# EAGLE design isp (EAGLE 9.6.2)
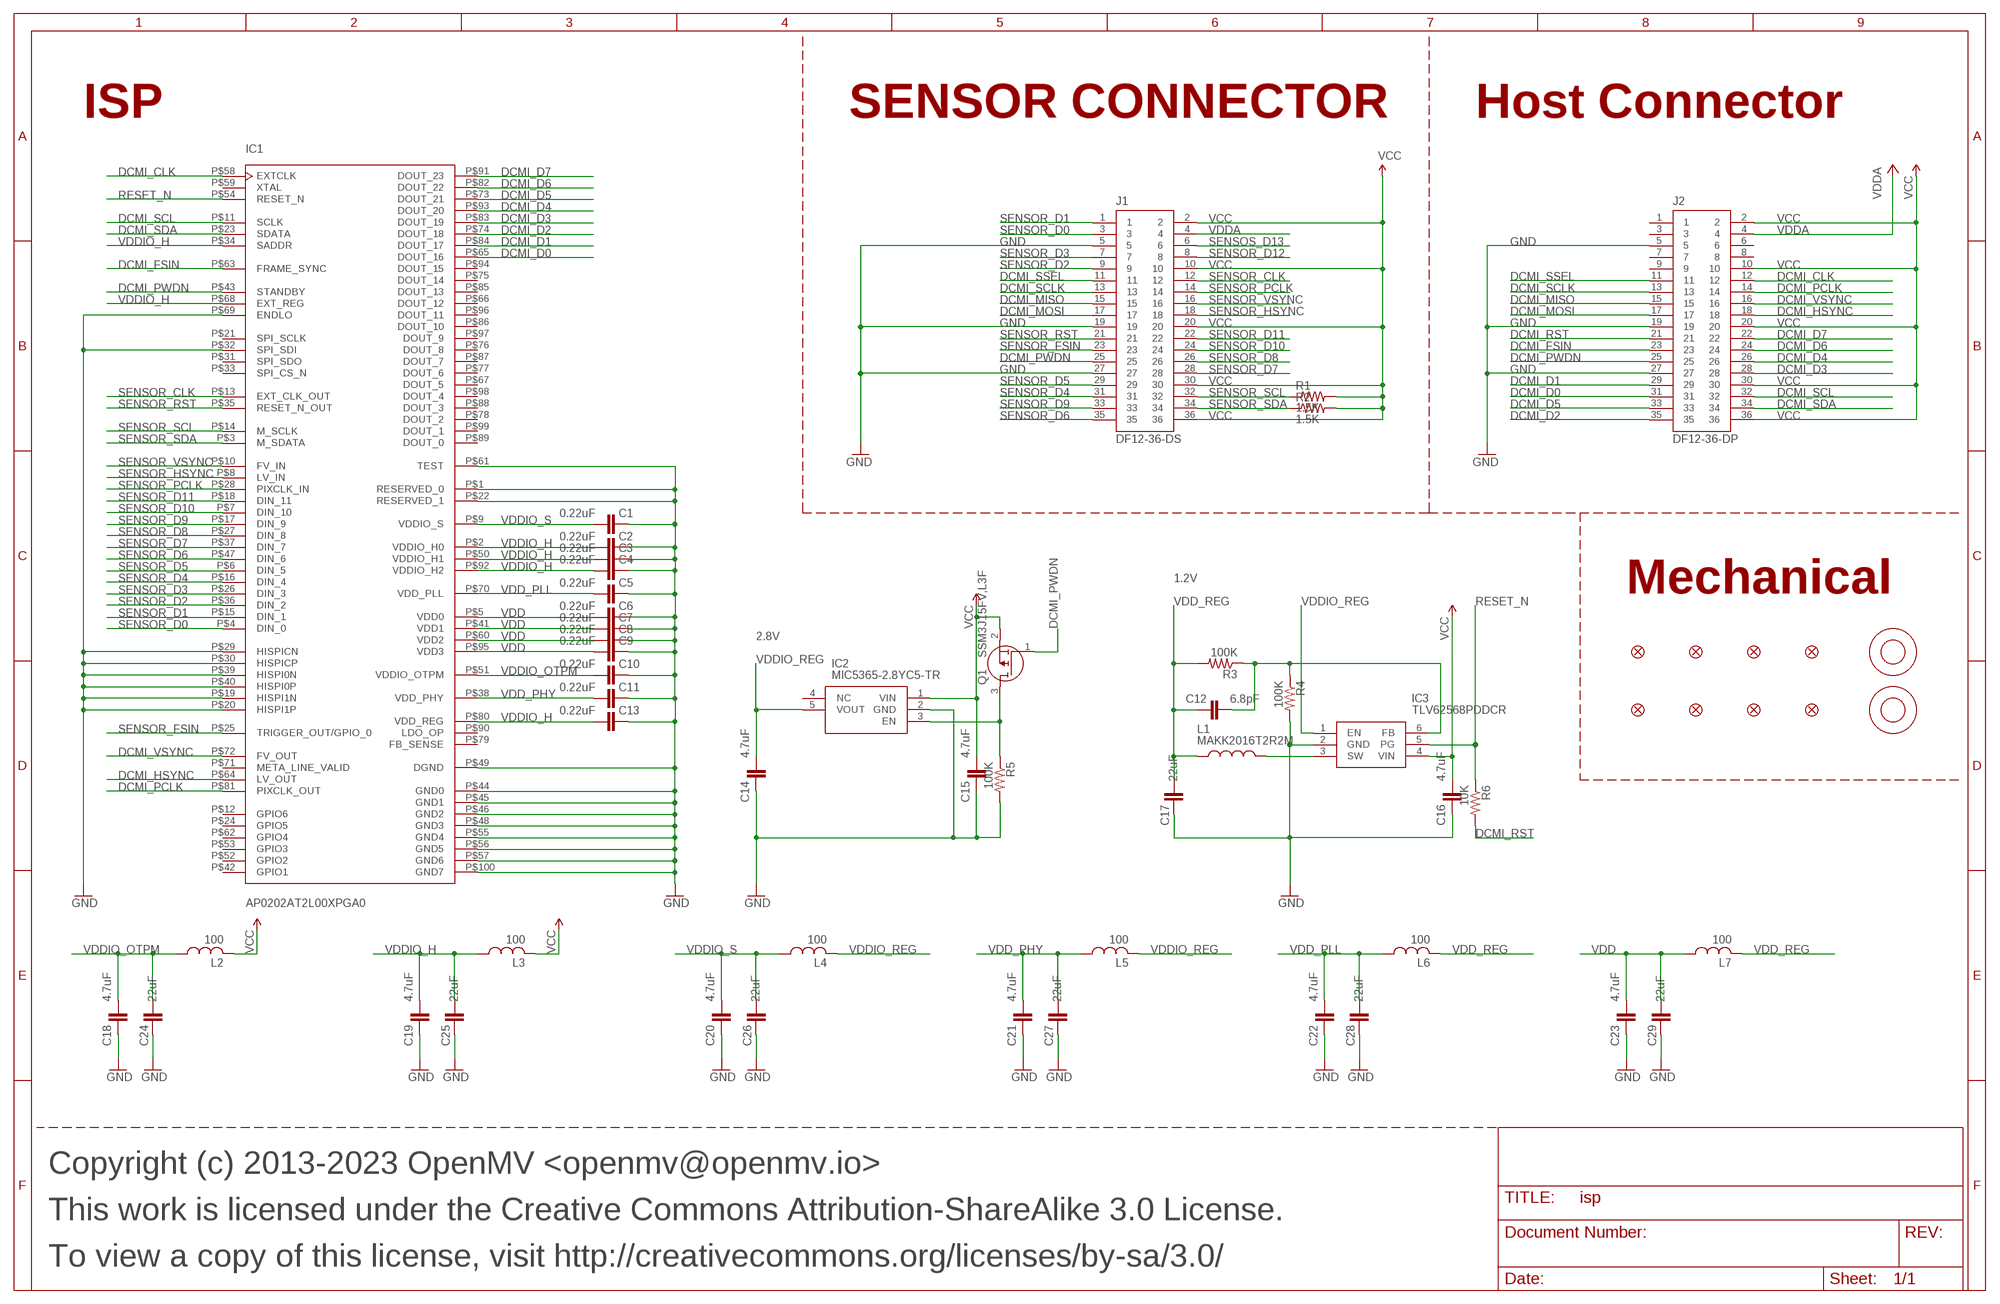
[diagram p0: schematic, sheet 1]

## Parts
C1  0.22uF  C-EUC0201  [C0201]
C2  0.22uF  C-EUC0201  [C0201]
C3  0.22uF  C-EUC0201  [C0201]
C4  0.22uF  C-EUC0201  [C0201]
C5  0.22uF  C-EUC0201  [C0201]
C6  0.22uF  C-EUC0201  [C0201]
C7  0.22uF  C-EUC0201  [C0201]
C8  0.22uF  C-EUC0201  [C0201]
C9  0.22uF  C-EUC0201  [C0201]
C10  0.22uF  C-EUC0201  [C0201]
C11  0.22uF  C-EUC0201  [C0201]
C12  6.8pF  CAP_0402  [0402]
C13  0.22uF  C-EUC0201  [C0201]
C14  4.7uF  CAP_0402  [0402]
C15  4.7uF  CAP_0402  [0402]
C16  4.7uF  CAP_0402  [0402]
C17  22uF  22UF-0805-6.3V-20%  [0805]
C18  4.7uF  CAP_0402  [0402]
C19  4.7uF  CAP_0402  [0402]
C20  4.7uF  CAP_0402  [0402]
C21  4.7uF  CAP_0402  [0402]
C22  4.7uF  CAP_0402  [0402]
C23  4.7uF  CAP_0402  [0402]
C24  22uF  22UF-0805-6.3V-20%  [0805]
C25  22uF  22UF-0805-6.3V-20%  [0805]
C26  22uF  22UF-0805-6.3V-20%  [0805]
C27  22uF  22UF-0805-6.3V-20%  [0805]
C28  22uF  22UF-0805-6.3V-20%  [0805]
C29  22uF  22UF-0805-6.3V-20%  [0805]
FD1  FIDUCIAL1X2  [FIDUCIAL-1X2]
FD2  FIDUCIAL1X2  [FIDUCIAL-1X2]
FD3  FIDUCIAL1X2  [FIDUCIAL-1X2]
FD4  FIDUCIAL1X2  [FIDUCIAL-1X2]
FD5  FIDUCIAL1X2  [FIDUCIAL-1X2]
FD6  FIDUCIAL1X2  [FIDUCIAL-1X2]
FD7  FIDUCIAL1X2  [FIDUCIAL-1X2]
FD8  FIDUCIAL1X2  [FIDUCIAL-1X2]
IC1  AP0202AT2L00XPGA0  [AP0202AT2L00XPGA0]
IC2  MIC5365-2.8YC5-TR  [SOT65P210X110-5N]
IC3  TLV62568PDDCR  [SOT95P280X110-6N]
J1  DF12-36-DS  [DF12-36-DS]
J2  DF12-36-DP  [DF12-36-DP]
L1  MAKK2016T2R2M  [INDC2016X100N]
L2  100  INDUCTOR_0402  [0402]
L3  100  INDUCTOR_0402  [0402]
L4  100  INDUCTOR_0402  [0402]
L5  100  INDUCTOR_0402  [0402]
L6  100  INDUCTOR_0402  [0402]
L7  100  INDUCTOR_0402  [0402]
M1  9774030151R  [9774030151R]
M2  9774030151R  [9774030151R]
Q1  SSM3J15FV,L3F  [SSM3J15FVL3F]
R1  1.5K  R-US_R0402  [R0402]
R2  1.5K  R-US_R0402  [R0402]
R3  100K  R-US_R0402  [R0402]
R4  100K  R-US_R0402  [R0402]
R5  100K  R-US_R0402  [R0402]
R6  10K  R-US_R0402  [R0402]

## Nets
DCMI_CLK [signal]: IC1.P$58(EXTCLK) J2.12
DCMI_D0 [signal]: IC1.P$65(DOUT_16) J2.31
DCMI_D1 [signal]: IC1.P$84(DOUT_17) J2.29
DCMI_D2 [signal]: IC1.P$74(DOUT_18) J2.35
DCMI_D3 [signal]: IC1.P$83(DOUT_19) J2.28
DCMI_D4 [signal]: IC1.P$93(DOUT_20) J2.26
DCMI_D5 [signal]: IC1.P$73(DOUT_21) J2.33
DCMI_D6 [signal]: IC1.P$82(DOUT_22) J2.24
DCMI_D7 [signal]: IC1.P$91(DOUT_23) J2.22
DCMI_FSIN [signal]: IC1.P$63(FRAME_SYNC) J2.23
DCMI_HSYNC [signal]: IC1.P$64(LV_OUT) J2.18
DCMI_MISO [signal]: J1.15 J2.15
DCMI_MOSI [signal]: J1.17 J2.17
DCMI_PCLK [signal]: IC1.P$81(PIXCLK_OUT) J2.14
DCMI_PWDN [signal]: IC1.P$43(STANDBY) J1.25 J2.25 Q1.1(G)
DCMI_PWDN_INT [signal]: IC2.3(EN) Q1.3(D) R5.1
DCMI_RST [signal]: J2.21 R6.2
DCMI_SCL [signal]: IC1.P$11(SCLK) J2.32
DCMI_SCLK [signal]: J1.13 J2.13
DCMI_SDA [signal]: IC1.P$23(SDATA) J2.34
DCMI_SSEL [signal]: J1.11 J2.11
DCMI_VSYNC [signal]: IC1.P$72(FV_OUT) J2.16
FB [pwr]: C12.2 IC3.6(FB) R3.1 R4.1
GND [gnd]: C1.1 C2.1 C3.1 C4.1 C5.1 C6.1 C7.1 C8.1 C9.1 C10.1 C11.1 C13.1 C14.1 C15.1 C16.1 C17.1 C18.1 C19.1 C20.1 C21.1 C22.1 C23.1 C24.1 C25.1 C26.1 C27.1 C28.1 C29.1 IC1.P$1(RESERVED_0) IC1.P$19(HISPI1N) IC1.P$20(HISPI1P) IC1.P$22(RESERVED_1) IC1.P$29(HISPICN) IC1.P$30(HISPICP) IC1.P$32(SPI_SDI) IC1.P$39(HISPI0N) IC1.P$40(HISPI0P) IC1.P$44(GND0) IC1.P$45(GND1) IC1.P$46(GND2) IC1.P$48(GND3) IC1.P$49(DGND) IC1.P$55(GND4) IC1.P$56(GND5) IC1.P$57(GND6) IC1.P$61(TEST) IC1.P$69(ENDLO) IC1.P$100(GND7) IC2.2(GND) IC3.2(GND) J1.5 J1.19 J1.27 J2.5 J2.19 J2.27 R4.2 R5.2
RESET_N [signal]: IC1.P$54(RESET_N) IC3.5(PG) R6.1
SENSOR_CLK [signal]: IC1.P$13(EXT_CLK_OUT) J1.12
SENSOR_D0 [signal]: IC1.P$4(DIN_0) J1.3
SENSOR_D1 [signal]: IC1.P$15(DIN_1) J1.1
SENSOR_D2 [signal]: IC1.P$36(DIN_2) J1.9
SENSOR_D3 [signal]: IC1.P$26(DIN_3) J1.7
SENSOR_D4 [signal]: IC1.P$16(DIN_4) J1.31
SENSOR_D5 [signal]: IC1.P$6(DIN_5) J1.29
SENSOR_D6 [signal]: IC1.P$47(DIN_6) J1.35
SENSOR_D7 [signal]: IC1.P$37(DIN_7) J1.28
SENSOR_D8 [signal]: IC1.P$27(DIN_8) J1.26
SENSOR_D9 [signal]: IC1.P$17(DIN_9) J1.33
SENSOR_D10 [signal]: IC1.P$7(DIN_10) J1.24
SENSOR_D11 [signal]: IC1.P$18(DIN_11) J1.22
SENSOR_D12 [signal]: J1.8
SENSOR_FSIN [signal]: IC1.P$25(TRIGGER_OUT/GPIO_0) J1.23
SENSOR_HSYNC [signal]: IC1.P$8(LV_IN) J1.18
SENSOR_PCLK [signal]: IC1.P$28(PIXCLK_IN) J1.14
SENSOR_RST [signal]: IC1.P$35(RESET_N_OUT) J1.21
SENSOR_SCL [signal]: IC1.P$14(M_SCLK) J1.32 R1.1
SENSOR_SDA [signal]: IC1.P$3(M_SDATA) J1.34 R2.1
SENSOR_VSYNC [signal]: IC1.P$10(FV_IN) J1.16
SENSOS_D13 [signal]: J1.6
SW [pwr]: IC3.3(SW) L1.2
VCC [pwr]: C15.2 C16.2 IC2.1(VIN) IC3.4(VIN) J1.2 J1.10 J1.20 J1.30 J1.36 J2.2 J2.10 J2.20 J2.30 J2.36 L2.2 L3.2 Q1.2(S) R1.2 R2.2
VDD [pwr]: C6.2 C7.2 C8.2 C9.2 C23.2 C29.2 IC1.P$5(VDD0) IC1.P$41(VDD1) IC1.P$60(VDD2) IC1.P$95(VDD3) L7.1
VDD_PHY [pwr]: C11.2 C21.2 C27.2 IC1.P$38(VDD_PHY) L5.1
VDD_PLL [pwr]: C5.2 C22.2 C28.2 IC1.P$70(VDD_PLL) L6.1
VDD_REG [pwr]: C12.1 C17.2 L1.1 L6.2 L7.2 R3.2
VDDA [pwr]: J1.4 J2.4
VDDIO_H [pwr]: C2.2 C3.2 C4.2 C13.2 C19.2 C25.2 IC1.P$2(VDDIO_H0) IC1.P$34(SADDR) IC1.P$50(VDDIO_H1) IC1.P$68(EXT_REG) IC1.P$80(VDD_REG) IC1.P$92(VDDIO_H2) L3.1
VDDIO_OTPM [pwr]: C10.2 C18.2 C24.2 IC1.P$51(VDDIO_OTPM) L2.1
VDDIO_REG [pwr]: C14.2 IC2.5(VOUT) IC3.1(EN) L4.2 L5.2
VDDIO_S [pwr]: C1.2 C20.2 C26.2 IC1.P$9(VDDIO_S) L4.1
Unconnected: IC1.P$12(GPIO6) IC1.P$21(SPI_SCLK) IC1.P$24(GPIO5) IC1.P$31(SPI_SDO) IC1.P$33(SPI_CS_N) IC1.P$42(GPIO1) IC1.P$52(GPIO2) IC1.P$53(GPIO3) IC1.P$59(XTAL) IC1.P$62(GPIO4) IC1.P$66(DOUT_12) IC1.P$67(DOUT_5) IC1.P$71(META_LINE_VALID) IC1.P$75(DOUT_14) IC1.P$76(DOUT_8) IC1.P$77(DOUT_6) IC1.P$78(DOUT_2) IC1.P$79(FB_SENSE) IC1.P$85(DOUT_13) IC1.P$86(DOUT_10) IC1.P$87(DOUT_7) IC1.P$88(DOUT_3) IC1.P$89(DOUT_0) IC1.P$90(LDO_OP) IC1.P$94(DOUT_15) IC1.P$96(DOUT_11) IC1.P$97(DOUT_9) IC1.P$98(DOUT_4) IC1.P$99(DOUT_1) IC2.4(NC) J2.1 J2.3 J2.6 J2.7 J2.8 J2.9

## Notes on the sheet
- ISP | SENSOR CONNECTOR | Host Connector
- 1.2V
- Mechanical
- 2.8V
- Copyright (c) 2013-2023 OpenMV <openmv@openmv.io>
- This work is licensed under the Creative Commons Attribution-ShareAlike 3.0 License.
- To view a copy of this license, visit http://creativecommons.org/licenses/by-sa/3.0/

## Library data of the parts
C1-C11 C13 = rcl:C-EU: CAPACITOR, European symbol; MPN: GRM033R60J224ME15D; SPICEPREFIX: C
C12 = 0402:CAP_0402: 0402 (1005 Metric) Nick Garner - TeleSense; MPN: GRM1555C1H6R8DA01D
C14-C16 C18-C23 = 0402:CAP_0402: 0402 (1005 Metric) Nick Garner - TeleSense; MPN: JMK105BBJ475MV-F
C17 C24-C29 = SparkFun-Capacitors:22UF: 22µF ceramic capacitors A capacitor is a passive two-terminal electrical component used to store electrical energy temporarily in an electric field.; MPN: CL21A226MQQNNNE; PROD_ID: CAP-08402
FD1-FD8 = SparkFun-Aesthetics:FIDUCIAL: Fiducial Alignment Points Point-of-reference for pick-and-place machines and other optical instruments.
IC1 = AP0202AT2L00XPGA0:AP0202AT2L00XPGA0; MPN: AP0202AT2L00XPGA0-DR
IC2 = MIC5365-2.8YC5-TR:MIC5365-2.8YC5-TR: IC REG LINEAR 2.8V 150MA SC70-5 Source: Datasheet <http://www.microchip.com/mymicrochip/filehandler.aspx?ddocname=en580022>; DESCRIPTION: IC REG LINEAR 2.8V 150MA SC70-5; HEIGHT: 1.1mm; MANUFACTURER_NAME: Microchip; MANUFACTURER_PART_NUMBER: MIC5365-2.8YC5-TR; MOUSER_PART_NUMBER: 998-MIC5365-2.8YC5TR; MOUSER_PRICE-STOCK: https://www.mouser.co.uk/ProductDetail/Microchip-Technology-Atmel/MIC5365-2.8YC5-TR?qs=U6T8BxXiZAX3mJDSWJyjVA%3D%3D; MPN: MIC5365-2.8YC5-TR
IC3 = TLV62568PDDCR:TLV62568PDDCR: 2.5V-5.5V input, 1A high efficiency step-down buck converter in SOT23 and SOT563 package Source: Datasheet <http://www.ti.com/lit/gpn/tlv62568>; DESCRIPTION: 2.5V-5.5V input, 1A high efficiency step-down buck converter in SOT23 and SOT563 package; HEIGHT: 1.1mm; MANUFACTURER_NAME: Texas Instruments; MANUFACTURER_PART_NUMBER: TLV62568PDDCR; MOUSER_PART_NUMBER: 595-TLV62568PDDCR; MOUSER_PRICE-STOCK: https://www.mouser.co.uk/ProductDetail/Texas-Instruments/TLV62568PDDCR?qs=1mbolxNpo8f1FPchIXcxyQ%3D%3D; MPN: TLV62568PDDCR
J1 = DF12-36-DS:DF12-36-DS; MPN: DF12NB(3.0)-36DS-0.5V(51)
J2 = DF12NB(3.0)-36DP-0.5V(51):DF12-36-DP; MPN: DF12NB(3.0)-36DP-0.5V(51)
L1 = MAKK2016T2R2M:MAKK2016T2R2M: INDUCTOR, METAL CORE Check availability <https://pricing.snapeda.com/parts/MAKK2016T2R2M/Taiyo%20Yuden/view-part?ref=eda>; AVAILABILITY: In Stock; DESCRIPTION: 2.2 µH Shielded Drum Core, Wirewound Inductor 1.5 A 160mOhm Max 0806 (2016 Metric); MF: Taiyo Yuden; MP: MAKK2016T2R2M; MPN: MAKK2016T2R2M; PACKAGE: 2016 Taiyo Yuden; PRICE: None; PURCHASE-URL: https://pricing.snapeda.com/search/part/MAKK2016T2R2M/?ref=eda
L2-L7 = 0402:INDUCTOR_0402; MPN: MFBM1V1005-101-R
M1 M2 = 9774030151R:9774030151R; MPN: 9774030151R
Q1 = SSM3J15FV_L3F:SSM3J15FV,L3F: MOSFET Small-signal MOSFET High Speed Switching Source: Datasheet <https://toshiba.semicon-storage.com/info/docget.jsp?did=593&prodName=SSM3J15FV>; DESCRIPTION: MOSFET Small-signal MOSFET High Speed Switching; HEIGHT: 0.55mm; MANUFACTURER_NAME: Toshiba; MANUFACTURER_PART_NUMBER: SSM3J15FV,L3F; MOUSER_PART_NUMBER: 757-SSM3J15FVL3F; MOUSER_PRICE-STOCK: https://www.mouser.co.uk/ProductDetail/Toshiba/SSM3J15FVL3F?qs=PDgMCp4xDJb4qTgE7FAUzA%3D%3D; MPN: SSM3J15FV,L3F
R1 R2 = rcl:R-US_: RESISTOR, American symbol; MPN: RC0402FR-131K5L; SPICEPREFIX: R
R3-R5 = rcl:R-US_: RESISTOR, American symbol; MPN: AC0402FR-07100KL; SPICEPREFIX: R
R6 = rcl:R-US_: RESISTOR, American symbol; MPN: AC0402FR-1310KL; SPICEPREFIX: R

## Net classes
0 default: width 0.076 mm, drill 0.102 mm, clearance 0.076 mm
2 gnd: width 0.076 mm, drill 0.102 mm, clearance 0.076 mm to class 0, clearance 0.076 mm to class 1, clearance 0.127 mm
3 pwr: width 0.076 mm, drill 0.102 mm, clearance 0.076 mm to class 0, clearance 0.076 mm to class 1, clearance 0.076 mm to class 2, clearance 0.127 mm
4 signal: width 0.076 mm, drill 0.102 mm, clearance 0.076 mm to class 0, clearance 0.076 mm to class 1, clearance 0.076 mm to class 2, clearance 0.076 mm to class 3, clearance 0.127 mm

## Board
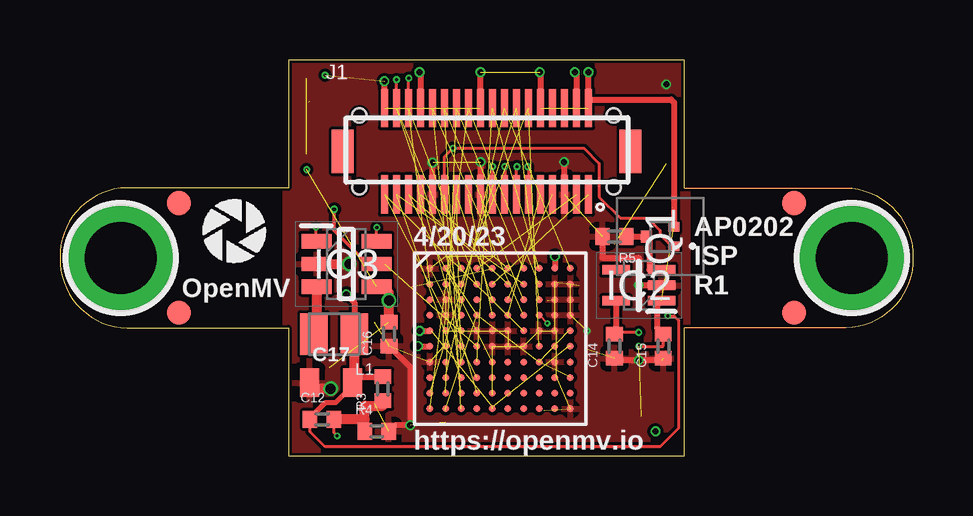
[diagram p1: board, top side]
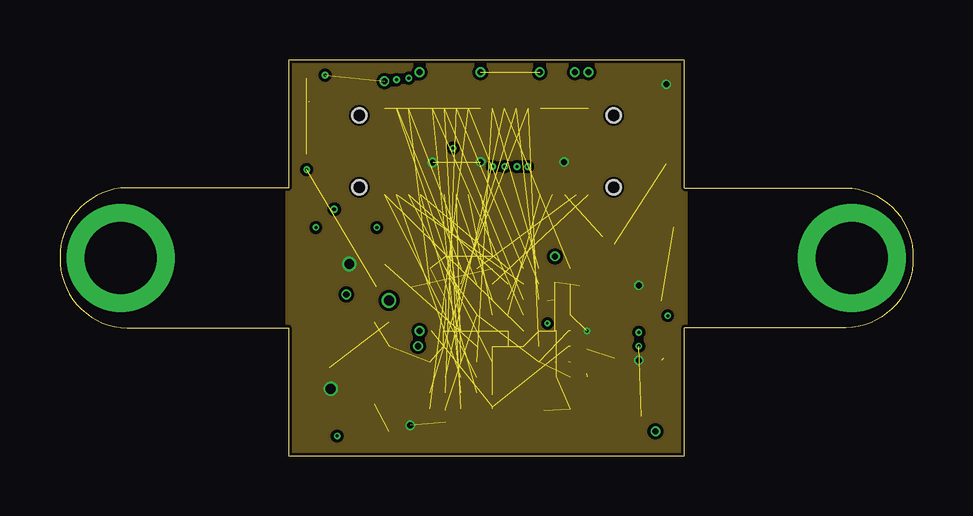
[diagram p2: board, inner layer GND]
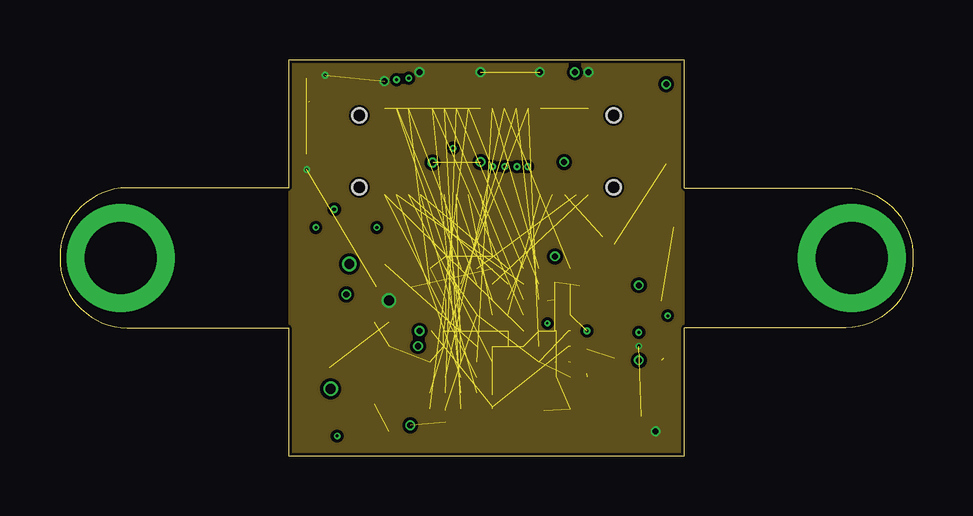
[diagram p3: board, inner layer VCC]
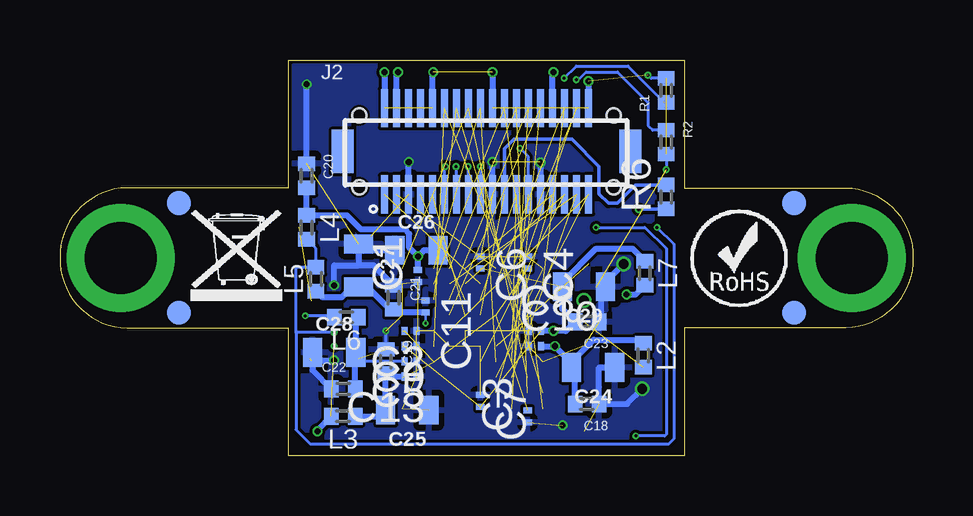
[diagram p4: board, bottom side, seen from below]

Size 35.56 x 16.51 mm. Coordinates in mm from the lower left corner, seen from the top.
Outline: 9.53,16.51 9.53,11.18 2.79,11.18 arc90 0,8.26 arc90 2.79,5.33 9.53,5.33 9.53,0 26.04,0 26.04,5.33 32.77,5.33 arc90 35.56,8.26 arc90 32.77,11.18 26.04,11.18 26.04,16.51 9.53,16.51
Copper layers (1*2*3*14*15*16): Top 0.035mm / dielectric 0.23mm / GND 0.035mm / dielectric 0.38mm / Route3 0.035mm / dielectric 0.15mm / Route14 0.035mm / dielectric 0.38mm / VCC 0.035mm / dielectric 0.23mm / Bottom 0.035mm
Design rules "MF_Ext_4_mil_drill_6_Layer *": minimum track width 3mil, minimum drill 4mil, track to track 3mil, track to pad 3mil, pad to pad 3mil, via to via 3mil, smd to smd 0mil, copper to edge 3mil, drill to drill 3mil, minimum pad ring 3mil, minimum via ring 3mil, stop-mask expansion 2mil, vias tented up to drill 25mil, thermal gap 10mil

### Footprints (pad centres in the part's own frame; a part is rotated, then mirrored left to right if it is on the bottom)
C0201 = smd 0.25 x 0.35: 1 -0.25,0; 2 0.25,0
0402 = smd 0.6 x 0.7: 1 -0.5,0; 2 0.5,0
0805 = smd 0.8 x 1.2: 1 -0.9,0; 2 0.9,0
FIDUCIAL-1X2 = smd 1 x 1: 1 0,0
AP0202AT2L00XPGA0 = smd 0.3 x 0.3: P$1 -2.925,2.925; P$2 -2.275,2.925; P$3 -1.625,2.925; P$4 -0.975,2.925; P$5 -0.325,2.925; P$6 0.325,2.925; P$7 0.975,2.925; P$8 1.625,2.925; P$9 2.275,2.925; P$10 2.925,2.925; P$11 -2.925,2.275; P$12 -2.275,2.275; P$13 -1.625,2.275; P$14 -0.975,2.275; P$15 -0.325,2.275; P$16 0.325,2.275; P$17 0.975,2.275; P$18 1.625,2.275; P$19 2.275,2.275; P$20 2.925,2.275; P$21 -2.925,1.625; P$22 -2.275,1.625; P$23 -1.625,1.625; P$24 -0.975,1.625; P$25 -0.325,1.625; P$26 0.325,1.625; P$27 0.975,1.625; P$28 1.625,1.625; P$29 2.275,1.625; P$30 2.925,1.625; P$31 -2.925,0.975; P$32 -2.275,0.975; P$33 -1.625,0.975; P$34 -0.975,0.975; P$35 -0.325,0.975; P$36 0.325,0.975; P$37 0.975,0.975; P$38 1.625,0.975; P$39 2.275,0.975; P$40 2.925,0.975; P$41 -2.925,0.325; P$42 -2.275,0.325; P$43 -1.625,0.325; P$44 -0.975,0.325; P$45 -0.325,0.325; P$46 0.325,0.325; P$47 0.975,0.325; P$48 1.625,0.325; P$49 2.275,0.325; P$50 2.925,0.325; P$51 -2.925,-0.325; P$52 -2.275,-0.325; P$53 -1.625,-0.325; P$54 -0.975,-0.325; P$55 -0.325,-0.325; P$56 0.325,-0.325; P$57 0.975,-0.325; P$58 1.625,-0.325; P$59 2.275,-0.325; P$60 2.925,-0.325; P$61 -2.925,-0.975; P$62 -2.275,-0.975; P$63 -1.625,-0.975; P$64 -0.975,-0.975; P$65 -0.325,-0.975; P$66 0.325,-0.975; P$67 0.975,-0.975; P$68 1.625,-0.975; P$69 2.275,-0.975; P$70 2.925,-0.975; P$71 -2.925,-1.625; P$72 -2.275,-1.625; P$73 -1.625,-1.625; P$74 -0.975,-1.625; P$75 -0.325,-1.625; P$76 0.325,-1.625; P$77 0.975,-1.625; P$78 1.625,-1.625; P$79 2.275,-1.625; P$80 2.925,-1.625; P$81 -2.925,-2.275; P$82 -2.275,-2.275; P$83 -1.625,-2.275; P$84 -0.975,-2.275; P$85 -0.325,-2.275; P$86 0.325,-2.275; P$87 0.975,-2.275; P$88 1.625,-2.275; P$89 2.275,-2.275; P$90 2.925,-2.275; P$91 -2.925,-2.925; P$92 -2.275,-2.925; P$93 -1.625,-2.925; P$94 -0.975,-2.925; P$95 -0.325,-2.925; P$96 0.325,-2.925; P$97 0.975,-2.925; P$98 1.625,-2.925; P$99 2.275,-2.925; P$100 2.925,-2.925
SOT65P210X110-5N = smd 1.15 x 0.4: 1 -0.95,0.65; 2 -0.95,0; 3 -0.95,-0.65; 4 0.95,-0.65; 5 0.95,0.65
SOT95P280X110-6N = smd 1.25 x 0.6: 1 -1.25,0.95; 2 -1.25,0; 3 -1.25,-0.95; 4 1.25,-0.95; 5 1.25,0; 6 1.25,0.95
DF12-36-DS = smd 0.3 x 1.6: 1 4.25,-1.8; 2 4.25,1.8; 3 3.75,-1.8; 4 3.75,1.8; 5 3.25,-1.8; 6 3.25,1.8; 7 2.75,-1.8; 8 2.75,1.8; 9 2.25,-1.8; 10 2.25,1.8; 11 1.75,-1.8; 12 1.75,1.8; 13 1.25,-1.8; 14 1.25,1.8; 15 0.75,-1.8; 16 0.75,1.8; 17 0.25,-1.8; 18 0.25,1.8; 19 -0.25,-1.8; 20 -0.25,1.8; 21 -0.75,-1.8; 22 -0.75,1.8; 23 -1.25,-1.8; 24 -1.25,1.8; 25 -1.75,-1.8; 26 -1.75,1.8; 27 -2.25,-1.8; 28 -2.25,1.8; 29 -2.75,-1.8; 30 -2.75,1.8; 31 -3.25,-1.8; 32 -3.25,1.8; 33 -3.75,-1.8; 34 -3.75,1.8; 35 -4.25,-1.8; 36 -4.25,1.8 | smd 0.9 x 1.8: F1 6,0; F2 -6,0 | hole 0.6: 5.3,-1.5; -5.3,-1.5
DF12-36-DP = smd 0.3 x 1.6: 1 -4.25,-1.8; 2 -4.25,1.8; 3 -3.75,-1.8; 4 -3.75,1.8; 5 -3.25,-1.8; 6 -3.25,1.8; 7 -2.75,-1.8; 8 -2.75,1.8; 9 -2.25,-1.8; 10 -2.25,1.8; 11 -1.75,-1.8; 12 -1.75,1.8; 13 -1.25,-1.8; 14 -1.25,1.8; 15 -0.75,-1.8; 16 -0.75,1.8; 17 -0.25,-1.8; 18 -0.25,1.8; 19 0.25,-1.8; 20 0.25,1.8; 21 0.75,-1.8; 22 0.75,1.8; 23 1.25,-1.8; 24 1.25,1.8; 25 1.75,-1.8; 26 1.75,1.8; 27 2.25,-1.8; 28 2.25,1.8; 29 2.75,-1.8; 30 2.75,1.8; 31 3.25,-1.8; 32 3.25,1.8; 33 3.75,-1.8; 34 3.75,1.8; 35 4.25,-1.8; 36 4.25,1.8 | smd 0.9 x 1.8: F1 -6,0; F2 6,0 | hole 0.6: -5.3,1.5; 5.3,1.5
INDC2016X100N = smd 1.14 x 1.73: 1 -0.847,0; 2 0.847,0
9774030151R = drill 3 pad 4.5: P$1 0,0
SSM3J15FVL3F = smd 0.4 x 0.45: 1 -0.4,-0.575; 2 0.4,-0.575 | smd 0.5 x 0.45: 3 0,0.575
R0402 = smd 0.6 x 0.7: 1 -0.5,0; 2 0.5,0

### Placement (x,y rotation side)
C1  20.64,7.49 90 bottom
C2  20.95,5.21 180 bottom
C3  16.07,1.65 90 bottom
C4  16.07,8.06 270 bottom
C5  20.95,3.94 180 bottom
C6  18.03,8.06 270 bottom
C7  18.03,2.29 270 bottom
C8  15.75,5.21 0 bottom
C9  20.95,4.57 180 bottom
C10  15.75,4.57 0 bottom
C11  20.32,6.22 270 bottom
C12  10.92,1.52 0 top
C13  20.95,3.3 180 bottom
C14  23.11,4.57 90 top
C15  25.15,4.57 90 top
C16  13.72,5.08 90 top
C17  11.3,3.05 0 top
C18  13.59,2.16 180 bottom
C19  21.97,3.94 270 bottom
C20  25.27,11.68 270 bottom
C21  21.65,6.6 270 bottom
C22  23.75,2.79 0 bottom
C23  13.59,5.59 180 bottom
C24  13.34,3.68 180 bottom
C25  21.08,1.91 180 bottom
C26  20.7,8.57 0 bottom
C27  23.11,7.94 270 bottom
C28  24.13,4.32 0 bottom
C29  13.72,7.05 180 bottom
FD1  30.61,5.97 0 top
FD2  30.61,10.54 0 top
FD3  30.61,10.54 0 bottom
FD4  30.61,5.97 0 bottom
FD5  4.95,5.97 0 top
FD6  4.95,10.54 0 top
FD7  4.95,10.54 0 bottom
FD8  4.95,5.97 0 bottom
IC1  18.35,4.89 0 top
IC2  24.13,7.11 180 top
IC3  11.94,8 0 top
J1  17.78,12.7 0 top
J2  17.78,12.7 0 bottom
L1  11.43,5.08 180 top
L2  11.24,4.19 270 bottom
L3  23.75,1.65 180 bottom
L4  25.27,9.53 270 bottom
L5  24.89,7.37 90 bottom
L6  23.62,5.78 180 bottom
L7  11.18,7.62 270 bottom
M1  2.54,8.26 0 top
M2  33.02,8.26 0 top
Q1  25.02,9.14 90 top
R1  10.29,15.24 90 bottom
R2  10.29,13.08 270 bottom
R3  13.46,2.79 90 top
R4  13.21,1.02 0 top
R5  23.11,9.14 180 top
R6  10.29,10.79 90 bottom
U$1  [WEEE]  30.1,6.48 0 bottom
U$2  [ROHS]  9.27,6.22 0 bottom
U$9  OPENMV-LOGO  [OPENMV-LOGO]  5.84,7.87 0 top

### Tracks (layer width: path | path; a pad name or v marks a point on that pad's centre or on a via)
DCMI_CLK  (1 unrouted)
DCMI_D0  (1 unrouted)
DCMI_D1  (1 unrouted)
DCMI_D2  (1 unrouted)
DCMI_D3  (1 unrouted)
DCMI_D4  (1 unrouted)
DCMI_D5  (1 unrouted)
DCMI_D6  (1 unrouted)
DCMI_D7  (1 unrouted)
DCMI_FSIN  (1 unrouted)
DCMI_HSYNC  (1 unrouted)
DCMI_MISO  (via drill 0.13)
  Top 0.127: v18.54,12.06 18.54,10.91 J1.15
  Bottom 0.127: J1.15 v18.53,12.05 v18.54,12.06
DCMI_MOSI  (via drill 0.13)
  Top 0.127: J1.17 v18.03,12.06
  Bottom 0.127: v18.03,12.06 J1.17
DCMI_PCLK  (1 unrouted)
DCMI_PWDN  (via drill 0.13)  (1 unrouted)
  Top 0.127: J1.25 16.03,12.47 v16.38,12.83 21.84,12.83 22.48,12.19 22.48,10.79 23.37,9.91 24.51,9.91 25.02,9.4 25.02,9.22 25.49,8.74 Q1.1
  Bottom 0.127: J1.25 16.03,12.47 v16.38,12.83
DCMI_PWDN_INT
  Top 0.254: R5.1 Q1.3 24.57,9.02 24.57,7.76 IC2.3
DCMI_RST
  Bottom 0.152: R6.2 11.56,11.29 12.32,10.54 12.7,10.54 13.08,10.92 13.08,12.06 14.22,13.21 16.64,13.21 17.03,12.81 J2.21
DCMI_SCL  (1 unrouted)
DCMI_SCLK  (via drill 0.13)
  Top 0.127: J1.13 19.03,12.04 v19.05,12.06
  Bottom 0.127: v19.05,12.06 19.05,10.92 J1.13
DCMI_SDA  (1 unrouted)
DCMI_SSEL  (via drill 0.13)
  Top 0.127: v19.49,12.06 19.53,12.03 J1.11
  Bottom 0.127: J1.11 19.53,12.03 v19.49,12.06
DCMI_VSYNC  (1 unrouted)
FB  (via drill 0.13)
  Top 0.127: IC3.6 13.19,9.51 v13.21,9.53 | v11.56,0.83 11.42,0.96 C12.2
  Top 0.254: R4.1 12.56,1.17 12.56,1.52
  Top 0.406: R3.1 13.46,2.09 12.71,2.09 12.71,1.52 | R4.1 12.71,1.52 | 12.71,1.52 C12.2
  Bottom 0.127: v13.21,9.53 11.18,9.53 10.29,8.64 10.29,0.89 10.35,0.83 v11.56,0.83
GND  (via drill 0.13, 0.25, 0.41)  (43 unrouted)
  Top 0.254: R4.2 13.96,1.27 v14.61,1.27 14.61,3.69 C16.1 | IC2.2 v24.13,7.11 24.13,8.26 22.61,8.26 R5.2 | 25.08,3.99 v24.13,3.99 23.2,3.99 C14.1 | J1.27 v15.53,12.23 15.56,12.26 | v17.53,12.26 v17.53,12.25 J1.19 | J1.5 21.03,12.24 v21.02,12.26
  Top 0.406: IC3.2 v12.06,8 | C17.1 10.66,2.79 v11.29,2.79 11.3,2.79
  Bottom 0.127: C19.1 v21.97,5.21
  Bottom 0.254: 24.31,2.79 C22.1 25.03,3.58 C28.1 24.7,3.99 v24.13,3.99 | 23.11,7.94 C27.1 22.85,8.57 C26.1 | v24.13,7.11 24.13,7.94 23.11,7.94 | v11.29,2.79 11.92,2.16 C18.1 13.09,3.68 C24.1 | v12.06,8 12.82,7.25 C29.1 13.02,6.85 13.02,5.66 C23.1 | C20.1 v25.27,15.49 | v15.53,12.23 J1.27 | J1.19 v17.53,12.25 v17.53,12.26 | J1.5 21.02,10.91 v21.02,12.26 | C21.1 22.49,7.94 23.11,7.94
  pour GND (isolate 0.127): 9.53,0 9.53,16.51 26.04,16.51 26.04,0
  pour Top (isolate 0.127): 9.4,-0.13 9.4,16.64 26.16,16.64 26.16,-0.13
  pour Bottom (isolate 0.127): 9.78,0.25 9.78,16.26 25.78,16.26 25.78,0.25
RESET_N  (via drill 0.15)  (1 unrouted)
  Top 0.152: 13.53,8 IC3.5 12.83,8 11.43,9.4 v11.43,10.29
  Bottom 0.152: v11.43,10.29 R6.1
SENSOR_CLK  (1 unrouted)
SENSOR_D0  (1 unrouted)
SENSOR_D1  (1 unrouted)
SENSOR_D2  (1 unrouted)
SENSOR_D3  (1 unrouted)
SENSOR_D4  (1 unrouted)
SENSOR_D5  (1 unrouted)
SENSOR_D6  (1 unrouted)
SENSOR_D7  (1 unrouted)
SENSOR_D8  (1 unrouted)
SENSOR_D9  (1 unrouted)
SENSOR_D10  (1 unrouted)
SENSOR_D11  (1 unrouted)
SENSOR_FSIN  (1 unrouted)
SENSOR_HSYNC  (1 unrouted)
SENSOR_PCLK  (1 unrouted)
SENSOR_RST  (1 unrouted)
SENSOR_SCL  (via drill 0.13)  (2 unrouted)
  Top 0.127: J1.32 14.53,15.74 v14.54,15.75
  Bottom 0.127: v14.54,15.75 14.03,16.26 11.87,16.26 10.4,14.78 | 10.36,14.74 R1.1
SENSOR_SDA  (via drill 0.13)  (1 unrouted)
  Top 0.127: J1.34 v14.03,15.68
  Bottom 0.127: v14.03,15.68 13.95,15.68 13.63,16 12.32,16 11.05,14.73 11.05,13.78 10.85,13.58 R2.1
SENSOR_VSYNC  (1 unrouted)
SW
  Top 0.406: IC3.3 10.69,5.18 L1.2
VCC  (via drill 0.13, 0.25, 0.41)  (10 unrouted)
  Top 0.127: v24.13,4.57 25.15,4.57 C15.2
  Top 0.254: IC2.1 24.89,6.27 24.89,5.33 C15.2 | J1.36 v13.53,15.62 | v14.99,16 15.03,16 J1.30 | J1.20 v17.53,16 | v20,16 20.03,16 J1.10 | v22.04,16 v22.03,16 J1.2 22.03,14.86 25.47,14.86 25.59,14.73 Q1.2 | v24.83,1.02 v24.83,1.03
  Top 0.406: C16.2 v13.72,6.48 13.72,6.79 13.46,7.05 IC3.4
  Bottom 0.127: R1.2 10.91,15.74 v11.05,15.88 | R2.2 v10.29,11.94
  Bottom 0.254: J1.20 v17.53,16 | v13.53,15.62 J1.36 | J1.30 15.03,16 v14.99,16 | J1.10 20.03,16 v20,16 | v22.04,16 J1.2 | L3.2 24.83,1.07 v24.83,1.02
  pour VCC (isolate 0.127): 9.65,0.13 9.65,16.38 25.91,16.38 25.91,0.13
VDD  (via drill 0.25)  (6 unrouted)
  Top 0.254: v14.99,5.21 IC1.P$41
  Bottom 0.254: C29.2 14.62,7.23 13.21,8.64 11.69,8.64 L7.1 | C29.2 14.55,6.99 | C8.2 v14.99,5.21 14.47,5.21 C23.2 14.62,6.12 C29.2
VDD_PHY  (via drill 0.1)
  Top 0.102: IC1.P$38 v20.32,5.52
  Bottom 0.102: C11.2 v20.32,5.52
  Bottom 0.254: C11.2 21.52,5.97 C21.2 21.8,6.1 22.74,7.04 C27.2 23.38,7.04 23.81,6.6 24.63,6.6 L5.1
VDD_PLL  (1 unrouted)
  Top 0.127: IC1.P$70 21.28,4
  Bottom 0.127: C5.2 22.48,3.94 23.23,3.94
  Bottom 0.254: C28.2 23.23,3.94 | C28.2 23.25,4.3 C22.2 | L6.1 23.23,5.67 C28.2
VDD_REG  (via drill 0.13, 0.25)
  Top 0.127: v25.34,5.84 25.59,5.84 25.79,5.65 25.79,1.15 25.01,0.38 11.05,0.38 10.42,1.01 C12.1
  Top 0.203: C12.1 10.42,1.59 11.06,2.23 11.5,2.23 12.28,3.01 12.28,3.12
  Top 0.254: v11.94,6.73 12.28,6.39 L1.1 | 12.28,3.12 12.28,3.3 | C17.2 12.45,3.29 R3.2
  Top 0.406: 12.28,3.3 L1.1 | 12.28,3.12 C17.2
  Bottom 0.127: L6.2 24.19,5.84 v25.34,5.84
  Bottom 0.254: v11.94,6.73 11.92,6.72 11.58,6.72 L7.2
VDDA  (via drill 0.25)
  Top 0.254: v21.46,16 21.53,15.94 J1.4
  Bottom 0.254: J1.4 21.53,15.94 v21.46,16
VDDIO_H  (10 unrouted)
  Bottom 0.254: 21.98,1.52 21.98,1.78 | 21.98,1.78 C25.2 21.98,3.29 | C19.2 21.97,3.3 C13.2 | L3.1 22.11,1.65 21.98,1.78
VDDIO_OTPM  (via drill 0.25)
  Top 0.254: v14.92,4.57 15.42,4.57 IC1.P$51
  Bottom 0.254: C24.2 14.23,3.93 13.32,4.84 11.39,4.84 L2.1 | C24.2 14.23,3.88 v14.92,4.57 C10.2 | C18.2 14.09,3.54 C24.2
VDDIO_REG  (via drill 0.13)
  Top 0.127: 10.67,8.97 v10.67,9.53 | v24.13,5.14 23.19,5.14 23.18,5.14
  Top 0.254: 23.11,6.4 IC2.5 23.18,5.14 C14.2 | IC3.1 10.67,8.97
  Bottom 0.127: v24.13,5.14 25.72,5.14 | 25.72,5.14 25.72,1.08 25.12,0.48 10.19,0.48 9.97,0.7 9.97,8.83 v10.67,9.53 | L4.2 24.89,8.64 L5.2 25.71,7.87 25.72,7.86 25.72,5.14
VDDIO_S  (via drill 0.25)
  Top 0.254: v20.64,8.32 20.64,7.83 IC1.P$9
  Bottom 0.254: C26.2 20.38,8.57 v20.64,8.32 | C1.2 v20.64,8.32 | v20.64,8.32 21,8.68 21,9.26 21.18,9.44 23.02,9.44 23.6,10.03 L4.1 C20.2

### Text on the board
tPlace: 4/20/23 | OpenMV | AP0202 / ISP / R1 | https://openmv.io